# Altium schematic sheet Sheet1.SchDoc
size A4; SheetNumber: 1; SheetTotal: 1
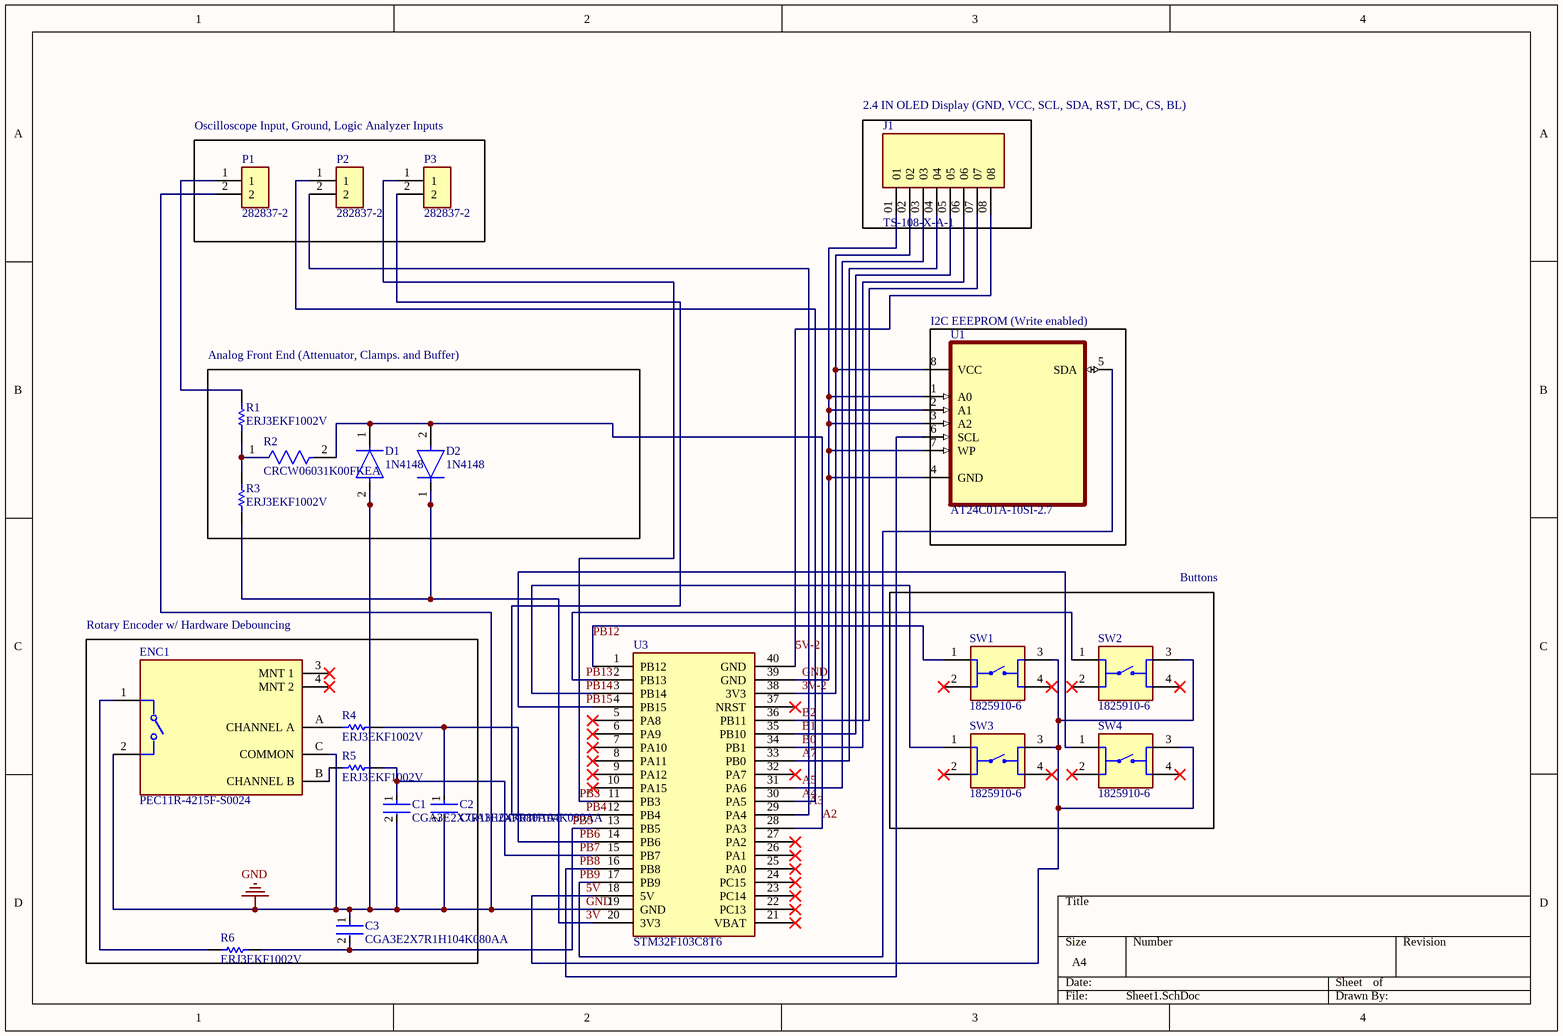
[diagram p0: Sheet1.SchDoc]

## Parts
C1  CGA3E2X7R1H104K080AA  [FP-CGA3E-0_3-0_1-IPC_A]
C2  CGA3E2X7R1H104K080AA  [FP-CGA3E-0_3-0_1-IPC_A]
C3  CGA3E2X7R1H104K080AA  [FP-CGA3E-0_3-0_1-IPC_A]
D1  1N4148  [FP-017AG-MFG]
D2  1N4148  [FP-017AG-MFG]
ENC1  PEC11R-4215F-S0024  [FP-PEC11R-4215F-S0024-MFG]
J1  TS-108-X-A-1  [SAMTEC_TS-108-X-A-1]
P1  282837-2  [TE_282837-2]
P2  282837-2  [TE_282837-2]
P3  282837-2  [TE_282837-2]
R1  ERJ3EKF1002V  [RESC1609X55X30LL15T15]
R2  CRCW06031K00FKEA  [FP-CRCW0603-e3-MFG]
R3  ERJ3EKF1002V  [RESC1609X55X30LL15T15]
R4  ERJ3EKF1002V  [RESC1609X55X30LL15T15]
R5  ERJ3EKF1002V  [RESC1609X55X30LL15T15]
R6  ERJ3EKF1002V  [RESC1609X55X30LL15T15]
SW1  1825910-6  [SW_1825910-6-4]
SW2  1825910-6  [SW_1825910-6-4]
SW3  1825910-6  [SW_1825910-6-4]
SW4  1825910-6  [SW_1825910-6-4]
U1  AT24C01A-10SI-2.7  [SOIC127P600X175-8N]
U3  STM32F103C8T6  [MODULE_ZC323000]

## Blocks framed on the sheet
2.4 IN OLED Display (GND, VCC, SCL, SDA, RST, DC, CS, BL): J1
Oscilloscope Input, Ground, Logic Analyzer Inputs: P1-P3
I2C EEEPROM (Write enabled): U1
Analog Front End (Attenuator, Clamps. and Buffer): D1 D2 R1-R3
Buttons: SW1-SW4
Rotary Encoder w/ Hardware Debouncing: C1-C3 ENC1 R4-R6

## Nets
GND: C1.2 C2.2 C3.1 D1.2(A) ENC1.2 ENC1.C(COMMON) J1.01 P1.2 U1.1(A0) U1.2(A1) U1.3(A2) U1.4(GND) U1.7(WP) U3.19(GND) U3.39(GND)
3V: D2.1(C) R3.2 U3.20(3V3)
3V-2: J1.02 U1.8(VCC) U3.38(3V3)
5V: SW1.3 SW2.3 SW3.3 SW4.3 U3.18(5V)
5V-2: J1.08 U3.40(GND)
A2: D1.1(C) D2.2(A) R2.2 U3.28(PA3)
A3: P2.2 U3.29(PA4)
A4: P2.1 U3.30(PA5)
A5: J1.03 U3.31(PA6)
A7: J1.04 U3.33(PB0)
B0: J1.06 U3.34(PB1)
B1: J1.05 U3.35(PB10)
B2: J1.07 U3.36(PB11)
PB3: P3.1 U3.11(PB3)
PB4: P3.2 U3.12(PB4)
PB5: C3.2 R6.2 U3.13(PB5)
PB6: C2.1 R4.2 U3.14(PB6)
PB7: C1.1 R5.2 U3.15(PB7)
PB8: U1.6(SCL) U3.16(PB8)
PB9: U1.5(SDA) U3.17(PB9)
PB12: SW1.1 U3.1(PB12)
PB13: SW2.1 U3.2(PB13)
PB14: SW3.1 U3.3(PB14)
PB15: SW4.1 U3.4(PB15)
NetENC1_1: ENC1.1 R6.1
NetENC1_A: ENC1.A(CHANNEL_A) R4.1
NetENC1_B: ENC1.B(CHANNEL_B) R5.1
NetP1_1: P1.1 R1.1
NetR1_2: R1.2 R2.1 R3.1

Not connected (* = marked no-connect by the designer): ENC1 3(MNT_1)* 4(MNT_2)*; SW1 2* 4*; SW2 2* 4*; SW3 2* 4*; SW4 2* 4*; U3 5(PA8)* 6(PA9)* 7(PA10)* 8(PA11)* 9(PA12)* 10(PA15)* 21(VBAT)* 22(PC13)* 23(PC14)* 24(PC15)* 25(PA0)* 26(PA1)* 27(PA2)* 32(PA7)* 37(NRST)*

## Library data of the parts
C1-C3 = CMP-2000-07546-2: Cap Ceramic 100nF 50V X7R 10% Pad SMD 0603 +125°C Automotive T/R; Weight: 7.1E-05oz; Composition: Ceramic; Max Operating Temperature: 125°C; Termination: SMD/SMT; Dielectric: X7R; Length: 1.6mm; Package Quantity: 1; REACH SVHC: No SVHC; Lead Free: Lead Free; Case Code (Metric): 1608; Min Operating Temperature: -55°C; Packaging: Tape and Reel; Tolerance: 10%; Voltage Rating: 50V; Case Code (Imperial): 0603; Capacitance: 100nF; Case/Package: 0603; Voltage Rating (DC): 50V; Depth: 0.8mm; Radiation Hardening: No; Ratings: AEC-Q200; Mount: Surface Mount; Voltage: 50V; Thickness: 0.035inch; Width: 0.8mm; Height: 0.8mm
D1 D2 = CMP-07163-000046-1: DIODE GEN PURP 100V 200MA DO35; Forward Voltage: 1V; Max Power Dissipation: 500mW; Max Reverse Current: 5uA; Forward Current: 300mA; Current: 4A; Reverse Recovery Time: 4ns; Element Configuration: Single; Outside Diameter: 1.85mm; Capacitance: 4pF; Polarity: Standard; Max Forward Surge Current (Ifsm): 1A; Reverse Voltage: 100V; Output Current: 200mA; Average Rectified Current: 200mA; Diameter: 1.91mm; Max Repetitive Reverse Voltage (Vrrm): 100V; Current Rating: 200mA; Case/Package: DO-35; Lead Free: Lead Free; Number of Pins: 2; Recovery Time: 4ns; Packaging: Bulk; Contact Plating: Tin; Voltage: 100V; Mount: Through Hole; Max Surge Current: 4A; Package Quantity: 2000; Width: 1.91mm; Max Reverse Voltage (DC): 100V; Length: 4.56mm; Radiation Hardening: No; Power Dissipation: 500mW; Voltage Rating (DC): 100V; Peak Non-Repetitive Surge Current: 4A; REACH SVHC: No SVHC; Height: 4.56mm; Max Operating Temperature: 175°C; Series: -; Weight: 0.01lb; Min Operating Temperature: -65°C
ENC1 = CMP-1747-00012-2: ROTARY ENCODER MECHANICAL 24PPR; Hole Diameter: 1.8mm; Output Type: Quadrature; Pulses per Revolution: 24; Number of Channels: 2; Built in Switch: Yes; Min Operating Temperature: -30°C; Series: PEC11R; Type: Mechanical; Package Quantity: 150; Length: 21.5mm; Max Operating Temperature: 70°C; Encoder Type: Mechanical; Height: 13.4mm; Detent: Yes; Packaging: Bulk; Orientation: Vertical; Width: 12.5mm; Termination: PC Pins; Mount: Through Hole; REACH SVHC: No SVHC; Radiation Hardening: No; RoHS Compliant: Yes
J1 = TS-108-X-A-1: TS Series .100 Single Row Screw Machine Terminal Strip; MP: TS-108-G-A-1; MF: Samtec; Availability: Bad; Value: *; Check_prices: https://www.snapeda.com/parts/TS-108-G-A-1/Samtec/view-part/4699387/?ref=eda; Package: None; Price: None; SnapEDA_Link: https://www.snapeda.com/parts/TS-108-G-A-1/Samtec/view-part/4699387/?ref=snap
P1-P3 = 282837-2: Ð Ð°Ð·ÑŠÐµÐ¼Ð½Ñ‹Ðµ ÐºÐ»ÐµÐ¼Ð¼Ð½Ñ‹Ðµ ÐºÐ¾Ð»Ð¾Ð´ÐºÐ¸ Ð Ð¾Ð·ÐµÑ‚ÐºÐ° 2 Ð¿Ð¾Ð»Ð¾Ð¶ÐµÐ½Ð¸Ñ 5,08 Ð¼Ð¼ ÐŸÑ€Ð¸Ð¿Ð¾Ð¹ Ð¿Ñ€ÑÐ¼Ð¾Ð¹ Ñ‡ÐµÑ€ÐµÐ· Ð¾Ñ‚Ð²ÐµÑ€ÑÑ‚Ð¸Ðµ 13,5 Ð / ÐºÐ¾Ð½Ñ‚Ð°ÐºÑ‚; MF: TE Connectivity; SnapEDA_Link: https://www.snapeda.com/parts/282837-2/TE+Connectivity+AMP+Connectors/view-part/?ref=snap; Price: None; Check_prices: https://www.snapeda.com/parts/282837-2/TE+Connectivity+AMP+Connectors/view-part/?ref=eda; Purchase-URL: https://pricing.snapeda.com/search/part/282837-2/?ref=eda; MP: 282837-2; Value: *; Availability: In Stock; Package: None
R1 R3-R6 = CMP-1012-00623-3: Chip Resistor, 10 KOhm, +/- 1%, 0.1 W, -55 to 155 degC, 0603 (1608 Metric), RoHS, Tape and Reel; Manufacturer: Panasonic; Voltage Rating: 75V; Case\/Package: 0603; Power Rating: 100mW; Resistance: 10KOhm; Temperature Coefficient: 100ppm\/degreesC; Number of Pins: 2; Package Reference: 603; Depth: 0.8mm; Mount: SurfaceMount; Package Description: 2-Pin Surface Mount Device, Body 1.6 x 0.85 mm; Datasheet Version: 02/2017; Length: 1.6mm; Lead Free: LeadFree; Height: 0.45mm; Number of Terminations: 2; Max Power Dissipation: 100mW; Min Operating Temperature: -55degC; Datasheet URL: https://industrial.panasonic.com/cdbs/www-data/pdf/RDA0000/AOA0000C304.pdf; Termination: SMD/SMT; Case Code (Metric): 1608; Case Code (Imperial): 0603; Tolerance: 1%; Max Operating Temperature: 155degC; RoHSCompliant: true; Voltage Rating (DC): 75V; Radiation Hardening: No; Packaging: TapeandReel; Composition: ThickFilm; Mounting Technology: SurfaceMount; Manufacturer URL: http://www.panasonic.com/; Width: 0.031inch; REACH SVHC: NoSVHC; Contact Plating: Tin; Military Standard: Not; Package Quantity: 1
R2 = CMP-1666-00003-5: RES Thick Film, 1kΩ, 1%, 0.1W, 100ppm/°C, 0603; Max Power Dissipation: 100mW; Voltage Rating: 75V; Resistance: 1kR; Max Operating Temperature: 155°C; Number of Pins: 2; Case Code (Imperial): 0603; Width: 0.033inch; Power Rating: 100mW; Number of Terminations: 2; Package Quantity: 10; Weight: 7.1E-05oz; Tolerance: 1%; Temperature Coefficient: 100ppm/°C; Military Standard: Not; Mount: Surface Mount; Voltage Rating (DC): 75V; Depth: 0.85mm; Composition: Thick Film; Radiation Hardening: No; Termination: SMD/SMT; Length: 1.55mm; Case Code (Metric): 1608; Contact Plating: Tin; Min Operating Temperature: -55°C; Packaging: Tape and Reel; Height: 0.45mm; Lead Free: Lead Free; Case/Package: 0603; Features: Automotive AEC-Q200
SW1-SW4 = 1825910-6: Switch Push Button OFF (ON) SPST Round Button 0.05A 24VDC Momentary Contact PC Pins Thru-Hole; MF: TE Connectivity; Value: *; MP: 1825910-6; Package: None; Check_prices: https://www.snapeda.com/parts/1825910-6/TE+Connectivity+ALCOSWITCH+Switches/view-part/?ref=eda; SnapEDA_Link: https://www.snapeda.com/parts/1825910-6/TE+Connectivity+ALCOSWITCH+Switches/view-part/?ref=snap; Digi-Key_Part_Number: 450-1650-ND; Purchase-URL: https://pricing.snapeda.com/search/part/1825910-6/?ref=eda
U1 = AT24C01A-10SI-2.7: Two-wire Serial EEPROM; Package: None; Price: None; Value: *; MP: AT24C01A-10SI-2.7; Availability: Unavailable
U3 = BluePill: Designed By @Alixahedi